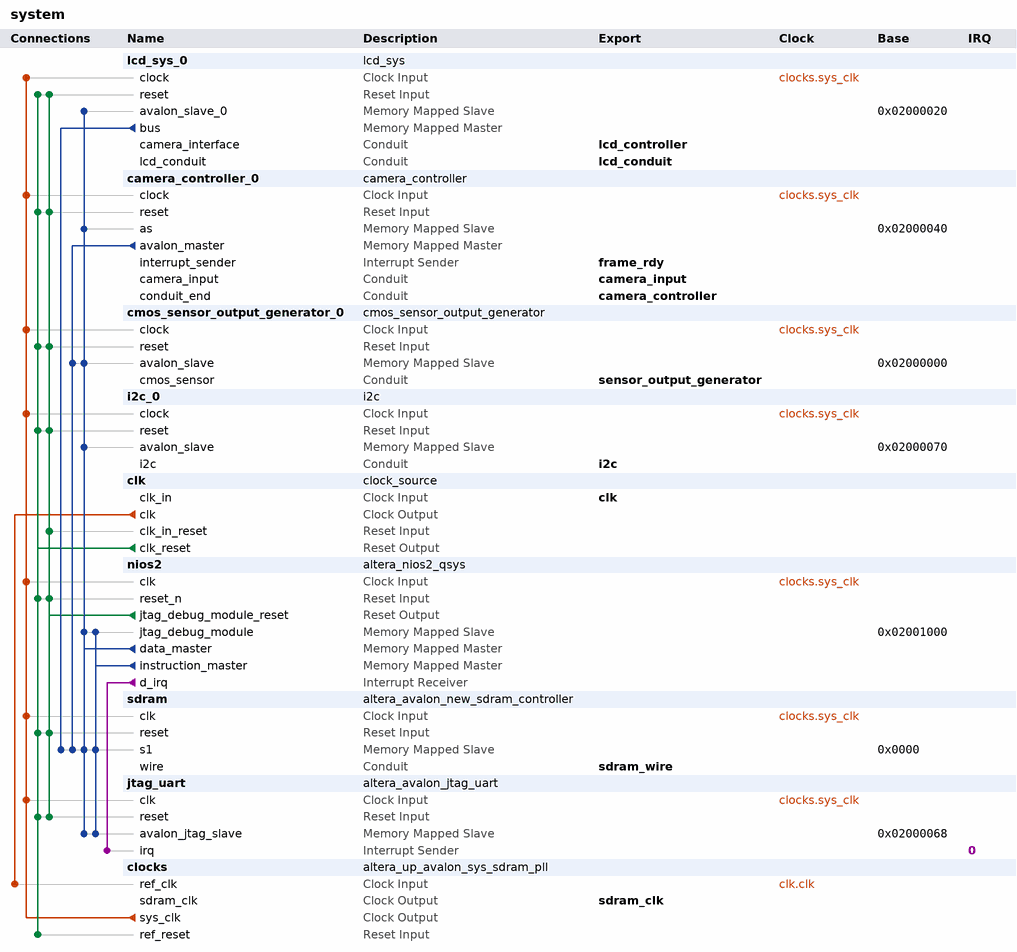
[diagram p0: system contents]
# Platform Designer (Qsys) system system, Cyclone IV E EP4CE22F17C6
# Parameters at their usual value, and those the tool derives, are not listed.
package require -exact qsys 15.0
create_system system
set_project_property DEVICE_FAMILY {Cyclone IV E}
set_project_property DEVICE EP4CE22F17C6

add_instance lcd_sys_0 lcd_sys 1.0

add_instance camera_controller_0 camera_controller 1.0

add_instance cmos_sensor_output_generator_0 cmos_sensor_output_generator 14.0
set_instance_parameter_value cmos_sensor_output_generator_0 PIX_DEPTH 12

add_instance i2c_0 i2c 14.0

add_instance clk clock_source 15.0
set_instance_parameter_value clk clockFrequency 50000000

add_instance nios2 altera_nios2_qsys 15.0
set_instance_parameter_value nios2 breakSlave nios2.jtag_debug_module
set_instance_parameter_value nios2 exceptionSlave sdram.s1
set_instance_parameter_value nios2 icache_size 4096
set_instance_parameter_value nios2 impl Small
set_instance_parameter_value nios2 mmu_TLBMissExcSlave None
set_instance_parameter_value nios2 resetSlave sdram.s1
set_instance_parameter_value nios2 resetrequest_enabled true

add_instance sdram altera_avalon_new_sdram_controller 15.0
set_instance_parameter_value sdram TAC 5.5
set_instance_parameter_value sdram TRCD 20.0
set_instance_parameter_value sdram TRP 20.0
set_instance_parameter_value sdram casLatency 3
set_instance_parameter_value sdram columnWidth 9
set_instance_parameter_value sdram dataWidth 16
set_instance_parameter_value sdram generateSimulationModel false
set_instance_parameter_value sdram model single_Micron_MT48LC4M32B2_7_chip
set_instance_parameter_value sdram numberOfBanks 4
set_instance_parameter_value sdram numberOfChipSelects 1
set_instance_parameter_value sdram powerUpDelay 100.0
set_instance_parameter_value sdram refreshPeriod 15.625
set_instance_parameter_value sdram rowWidth 13

add_instance jtag_uart altera_avalon_jtag_uart 15.0
set_instance_parameter_value jtag_uart simInteractiveOptions NO_INTERACTIVE_WINDOWS

add_instance clocks altera_up_avalon_sys_sdram_pll 15.0
set_instance_parameter_value clocks CIV_boards DE0-Nano
set_instance_parameter_value clocks CV_boards DE1-SoC
set_instance_parameter_value clocks gui_outclk 50.0
set_instance_parameter_value clocks gui_refclk 50.0

# connections
add_connection clk.clk clocks.ref_clk clock
add_connection clocks.sys_clk camera_controller_0.clock clock
add_connection clocks.sys_clk cmos_sensor_output_generator_0.clock clock
add_connection clocks.sys_clk i2c_0.clock clock
add_connection clocks.sys_clk jtag_uart.clk clock
add_connection clocks.sys_clk lcd_sys_0.clock clock
add_connection clocks.sys_clk nios2.clk clock
add_connection clocks.sys_clk sdram.clk clock
add_connection clk.clk_reset camera_controller_0.reset reset
add_connection clk.clk_reset clocks.ref_reset reset
add_connection clk.clk_reset cmos_sensor_output_generator_0.reset reset
add_connection clk.clk_reset i2c_0.reset reset
add_connection clk.clk_reset jtag_uart.reset reset
add_connection clk.clk_reset lcd_sys_0.reset reset
add_connection clk.clk_reset nios2.reset_n reset
add_connection clk.clk_reset sdram.reset reset
add_connection nios2.jtag_debug_module_reset camera_controller_0.reset reset
add_connection nios2.jtag_debug_module_reset clk.clk_in_reset reset
add_connection nios2.jtag_debug_module_reset cmos_sensor_output_generator_0.reset reset
add_connection nios2.jtag_debug_module_reset i2c_0.reset reset
add_connection nios2.jtag_debug_module_reset jtag_uart.reset reset
add_connection nios2.jtag_debug_module_reset lcd_sys_0.reset reset
add_connection nios2.jtag_debug_module_reset nios2.reset_n reset
add_connection nios2.jtag_debug_module_reset sdram.reset reset
add_connection camera_controller_0.avalon_master cmos_sensor_output_generator_0.avalon_slave avalon
set_connection_parameter_value camera_controller_0.avalon_master/cmos_sensor_output_generator_0.avalon_slave baseAddress 0x02000000
add_connection camera_controller_0.avalon_master sdram.s1 avalon
set_connection_parameter_value camera_controller_0.avalon_master/sdram.s1 baseAddress 0x0000
add_connection lcd_sys_0.bus sdram.s1 avalon
set_connection_parameter_value lcd_sys_0.bus/sdram.s1 baseAddress 0x0000
add_connection nios2.data_master camera_controller_0.as avalon
set_connection_parameter_value nios2.data_master/camera_controller_0.as baseAddress 0x02000040
add_connection nios2.data_master cmos_sensor_output_generator_0.avalon_slave avalon
set_connection_parameter_value nios2.data_master/cmos_sensor_output_generator_0.avalon_slave baseAddress 0x02000000
add_connection nios2.data_master i2c_0.avalon_slave avalon
set_connection_parameter_value nios2.data_master/i2c_0.avalon_slave baseAddress 0x02000070
add_connection nios2.data_master jtag_uart.avalon_jtag_slave avalon
set_connection_parameter_value nios2.data_master/jtag_uart.avalon_jtag_slave baseAddress 0x02000068
add_connection nios2.data_master lcd_sys_0.avalon_slave_0 avalon
set_connection_parameter_value nios2.data_master/lcd_sys_0.avalon_slave_0 baseAddress 0x02000020
add_connection nios2.data_master nios2.jtag_debug_module avalon
set_connection_parameter_value nios2.data_master/nios2.jtag_debug_module baseAddress 0x02001000
add_connection nios2.data_master sdram.s1 avalon
set_connection_parameter_value nios2.data_master/sdram.s1 baseAddress 0x0000
add_connection nios2.instruction_master jtag_uart.avalon_jtag_slave avalon
set_connection_parameter_value nios2.instruction_master/jtag_uart.avalon_jtag_slave baseAddress 0x02000068
add_connection nios2.instruction_master nios2.jtag_debug_module avalon
set_connection_parameter_value nios2.instruction_master/nios2.jtag_debug_module baseAddress 0x02001000
add_connection nios2.instruction_master sdram.s1 avalon
set_connection_parameter_value nios2.instruction_master/sdram.s1 baseAddress 0x0000
add_connection nios2.d_irq jtag_uart.irq interrupt
set_connection_parameter_value nios2.d_irq/jtag_uart.irq irqNumber 0

# exported interfaces
add_interface camera_controller conduit end
set_interface_property camera_controller EXPORT_OF camera_controller_0.conduit_end
add_interface camera_input conduit end
set_interface_property camera_input EXPORT_OF camera_controller_0.camera_input
add_interface clk clock sink
set_interface_property clk EXPORT_OF clk.clk_in
add_interface frame_rdy interrupt sender
set_interface_property frame_rdy EXPORT_OF camera_controller_0.interrupt_sender
add_interface i2c conduit end
set_interface_property i2c EXPORT_OF i2c_0.i2c
add_interface lcd_conduit conduit end
set_interface_property lcd_conduit EXPORT_OF lcd_sys_0.lcd_conduit
add_interface lcd_controller conduit end
set_interface_property lcd_controller EXPORT_OF lcd_sys_0.camera_interface
add_interface sdram_clk clock source
set_interface_property sdram_clk EXPORT_OF clocks.sdram_clk
add_interface sdram_wire conduit end
set_interface_property sdram_wire EXPORT_OF sdram.wire
add_interface sensor_output_generator conduit end
set_interface_property sensor_output_generator EXPORT_OF cmos_sensor_output_generator_0.cmos_sensor

set_interconnect_requirement {$system} qsys_mm.clockCrossingAdapter HANDSHAKE
set_interconnect_requirement {$system} qsys_mm.enableEccProtection FALSE
set_interconnect_requirement {$system} qsys_mm.insertDefaultSlave FALSE
set_interconnect_requirement {$system} qsys_mm.maxAdditionalLatency 1

save_system system.qsys
